# EAGLE schematic scheda_trasduttori (EAGLE 6.5.0)

## Sheet 1 of 4
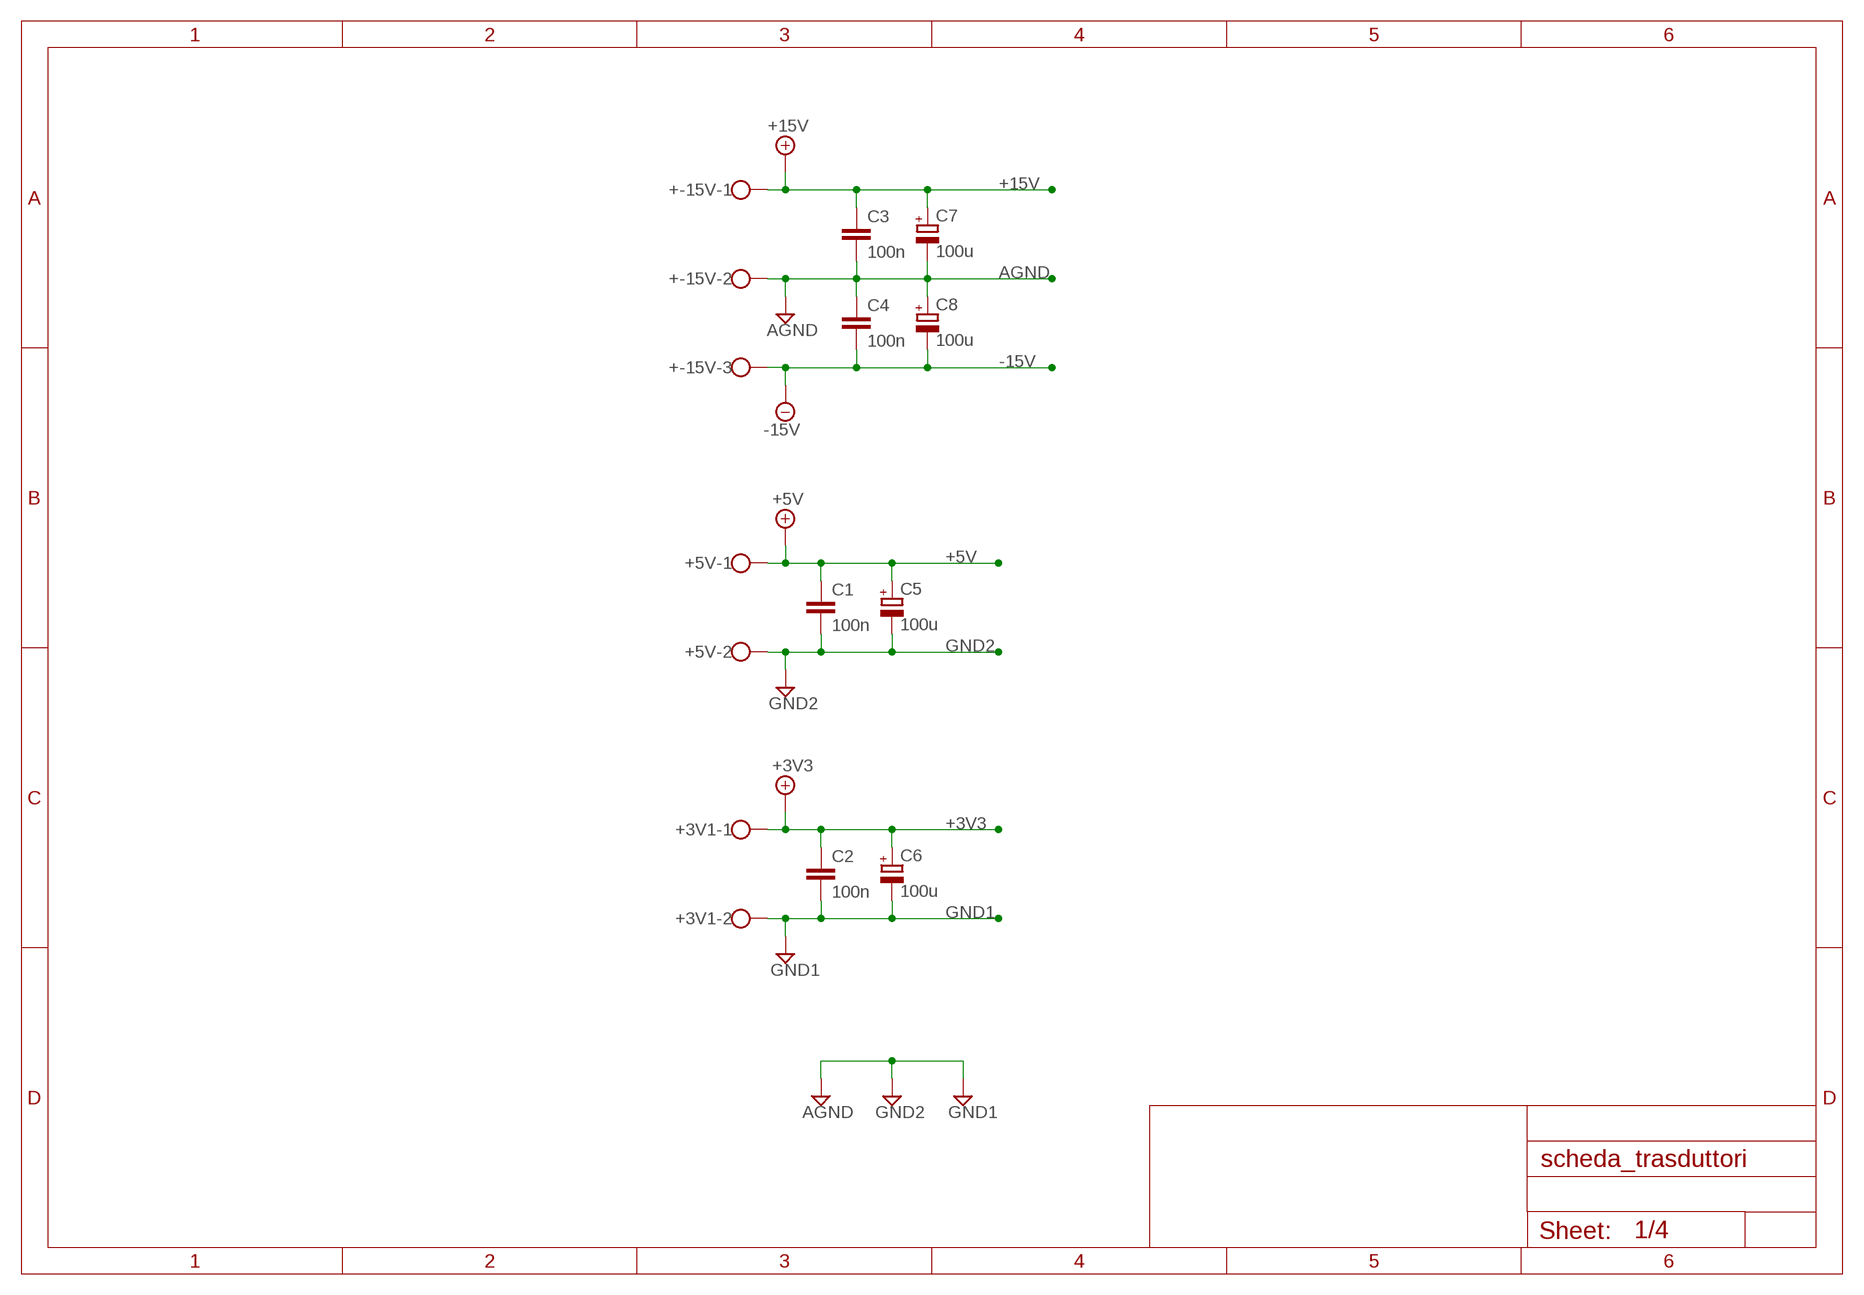
[diagram p0: schematic, sheet 1]

### Parts
+3V1  W237-102  [W237-102]
+5V  W237-102  [W237-102]
+-15V  W237-103  [W237-103]
C1  100n  C2,5-3  [C2.5-3]
C2  100n  C2,5-3  [C2.5-3]
C3  100n  C2,5-3  [C2.5-3]
C4  100n  C2,5-3  [C2.5-3]
C5  100u  CPOL-EUE2.5-7  [E2,5-7]
C6  100u  CPOL-EUE2.5-7  [E2,5-7]
C7  100u  CPOL-EUE2.5-7  [E2,5-7]
C8  100u  CPOL-EUE2.5-7  [E2,5-7]

### Nets
+3V3: +3V1.1 C2.1 C6.+
+5V: +5V.1 C1.1 C5.+ ; also sheet 2,4
+15V: +-15V.1 C3.1 C7.+ ; also sheet 2,3,4
-15V: +-15V.3 C4.2 C8.- ; also sheet 2,3,4
AGND: +-15V.2 C3.2 C4.1 C7.- C8.+ ; also sheet 2,3,4
GND1: +3V1.2 C2.2 C6.- ; also sheet 3
GND2: +5V.2 C1.2 C5.- ; supply symbol labelled AGND, GND1 ; also sheet 2,4

## Sheet 2 of 4
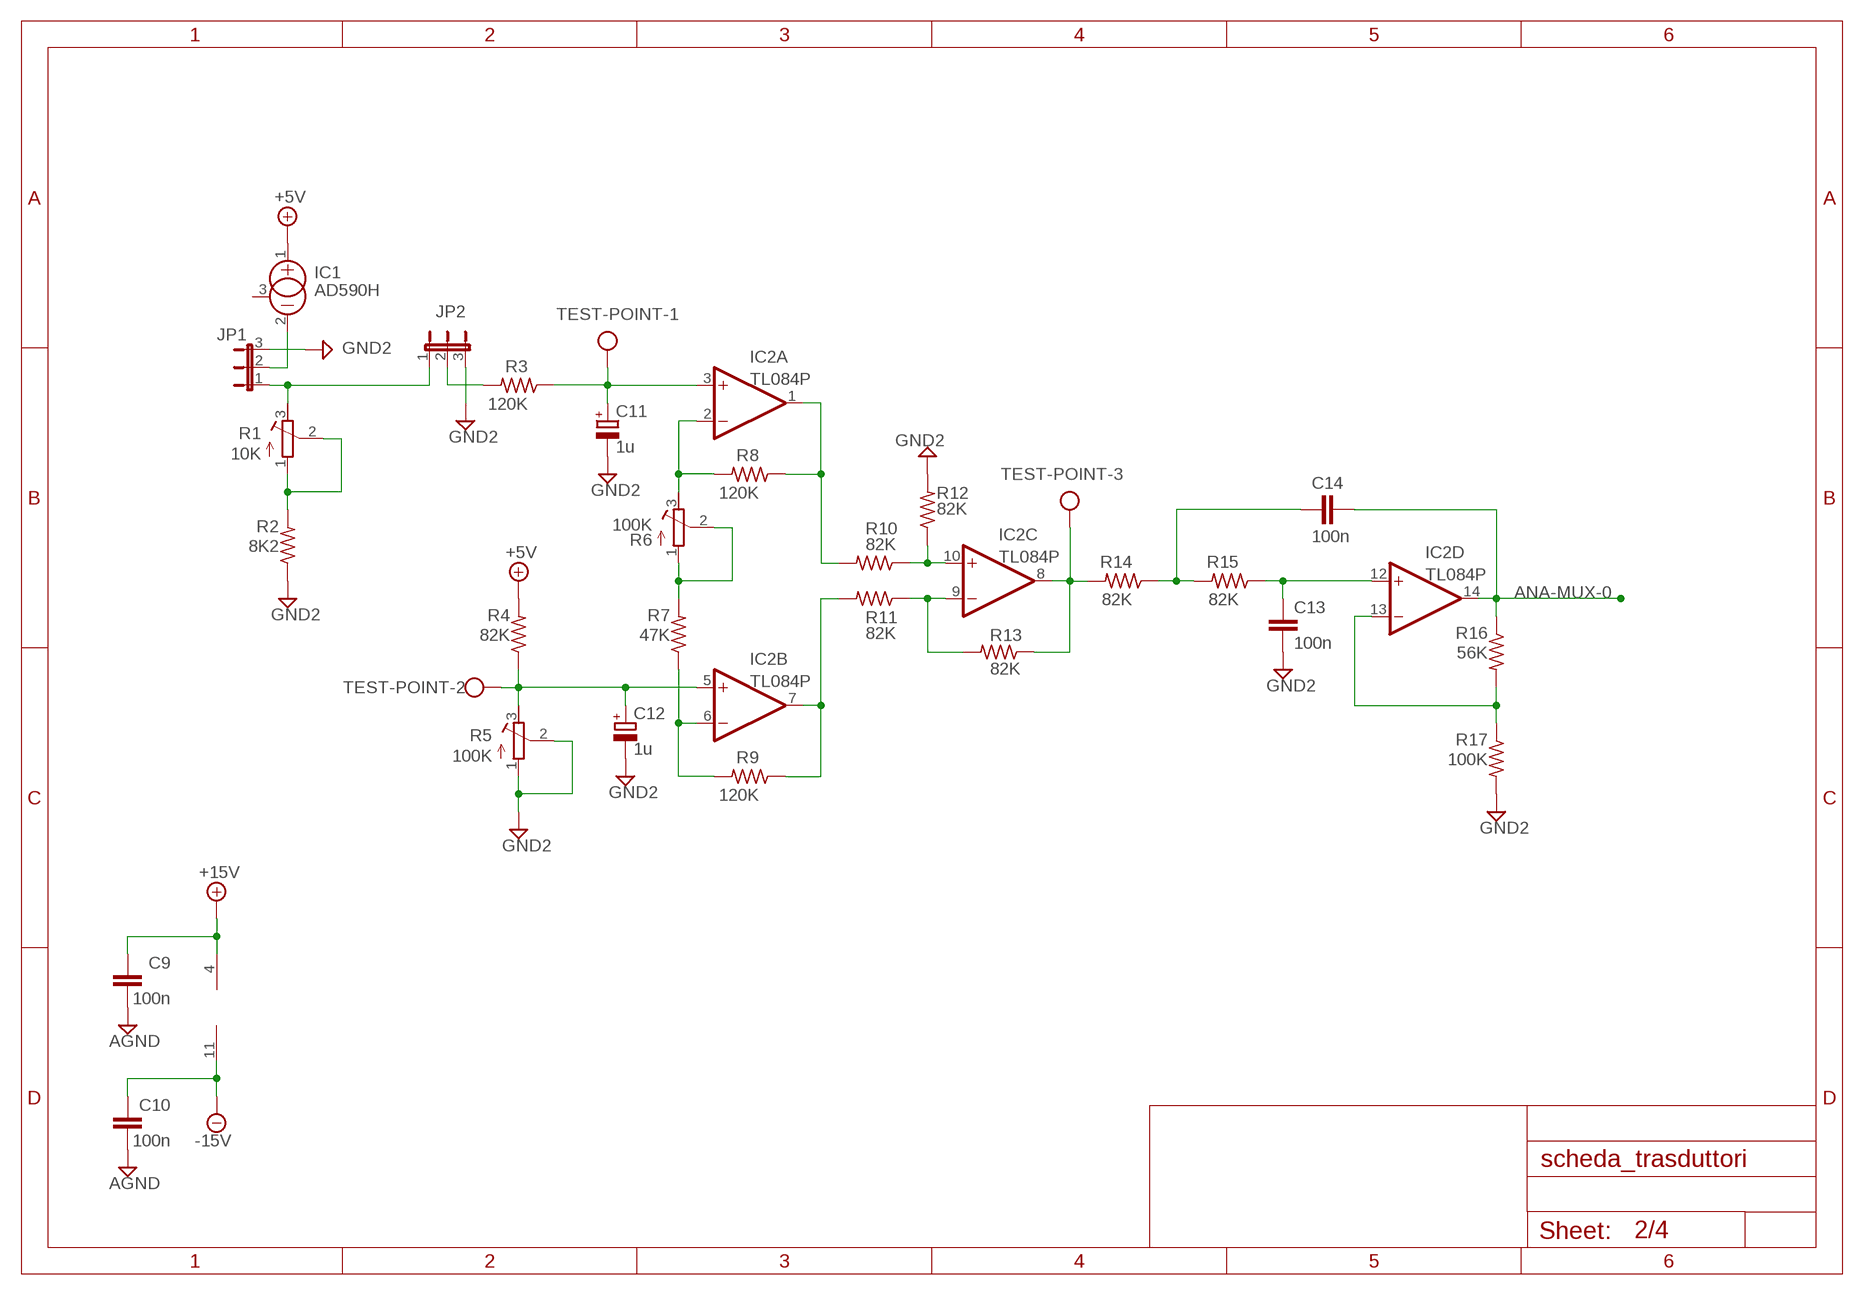
[diagram p1: schematic, sheet 2]

### Parts
C9  100n  C-EU025-024X044  [C025-024X044]
C10  100n  C-EU025-024X044  [C025-024X044]
C11  1u  CPOL-EUE5-8.5  [E5-8,5]
C12  1u  CPOL-EUE5-8.5  [E5-8,5]
C13  100n  C-EU025-024X044  [C025-024X044]
C14  100n  C-EU025-024X044  [C025-024X044]
IC1  AD590H  [TO18]
IC2  TL084P  [DIL14]
JP1  JP2E  [JP2]
JP2  JP2E  [JP2]
R1  10K  R-TRIMM64W  [RTRIM64W]
R2  8K2  R-US_0204/7  [0204/7]
R3  120K  R-US_0204/7  [0204/7]
R4  82K  R-US_0204/7  [0204/7]
R5  100K  R-TRIMM64W  [RTRIM64W]
R6  100K  R-TRIMM64W  [RTRIM64W]
R7  47K  R-US_0204/7  [0204/7]
R8  120K  R-US_0204/7  [0204/7]
R9  120K  R-US_0204/7  [0204/7]
R10  82K  R-US_0204/7  [0204/7]
R11  82K  R-US_0204/7  [0204/7]
R12  82K  R-US_0204/7  [0204/7]
R13  82K  R-US_0204/7  [0204/7]
R14  82K  R-US_0204/7  [0204/7]
R15  82K  R-US_0204/7  [0204/7]
R16  56K  R-US_0204/7  [0204/7]
R17  100K  R-US_0204/7  [0204/7]
TEST-POINT  W237-103  [W237-103]

### Nets
+5V: IC1.1(+) R4.2 ; also sheet 1,4
+15V: C9.2 IC2.4(P:V+) ; also sheet 1,3,4
-15V: C10.2 IC2.11(P:V-) ; also sheet 1,3,4
AGND: C9.1 C10.1 ; also sheet 1,3,4
ANA-MUX-0: C14.2 IC2.14(D:OUT) R16.1
GND2: C11.- C12.- C13.1 JP1.3 JP2.3 R2.1 R5.1(E) R5.2(S) R12.2 R17.2 ; also sheet 1,4
N$1: R1.1(E) R1.2(S) R2.2
N$2: IC1.2(-) JP1.2
N$3: R6.1(E) R6.2(S) R7.2
N$4: C11.+ IC2.3(A:+IN) R3.1 TEST-POINT.1
N$5: IC2.2(A:-IN) R6.3(A) R8.2
N$6: IC2.1(A:OUT) R8.1 R10.2
N$7: JP2.2 R3.2
N$8: JP1.1 JP2.1 R1.3(A)
N$9: C12.+ IC2.5(B:+IN) R4.1 R5.3(A) TEST-POINT.2
N$10: IC2.6(B:-IN) R7.1 R9.2
N$11: IC2.7(B:OUT) R9.1 R11.2
N$12: IC2.10(C:+IN) R10.1 R12.1
N$13: IC2.9(C:-IN) R11.1 R13.2
N$14: IC2.8(C:OUT) R13.1 R14.2 TEST-POINT.3
N$16: C14.1 R14.1 R15.2
N$17: C13.2 IC2.12(D:+IN) R15.1
N$18: IC2.13(D:-IN) R16.2 R17.1
Unconnected: IC1.3(CAN)

## Sheet 3 of 4
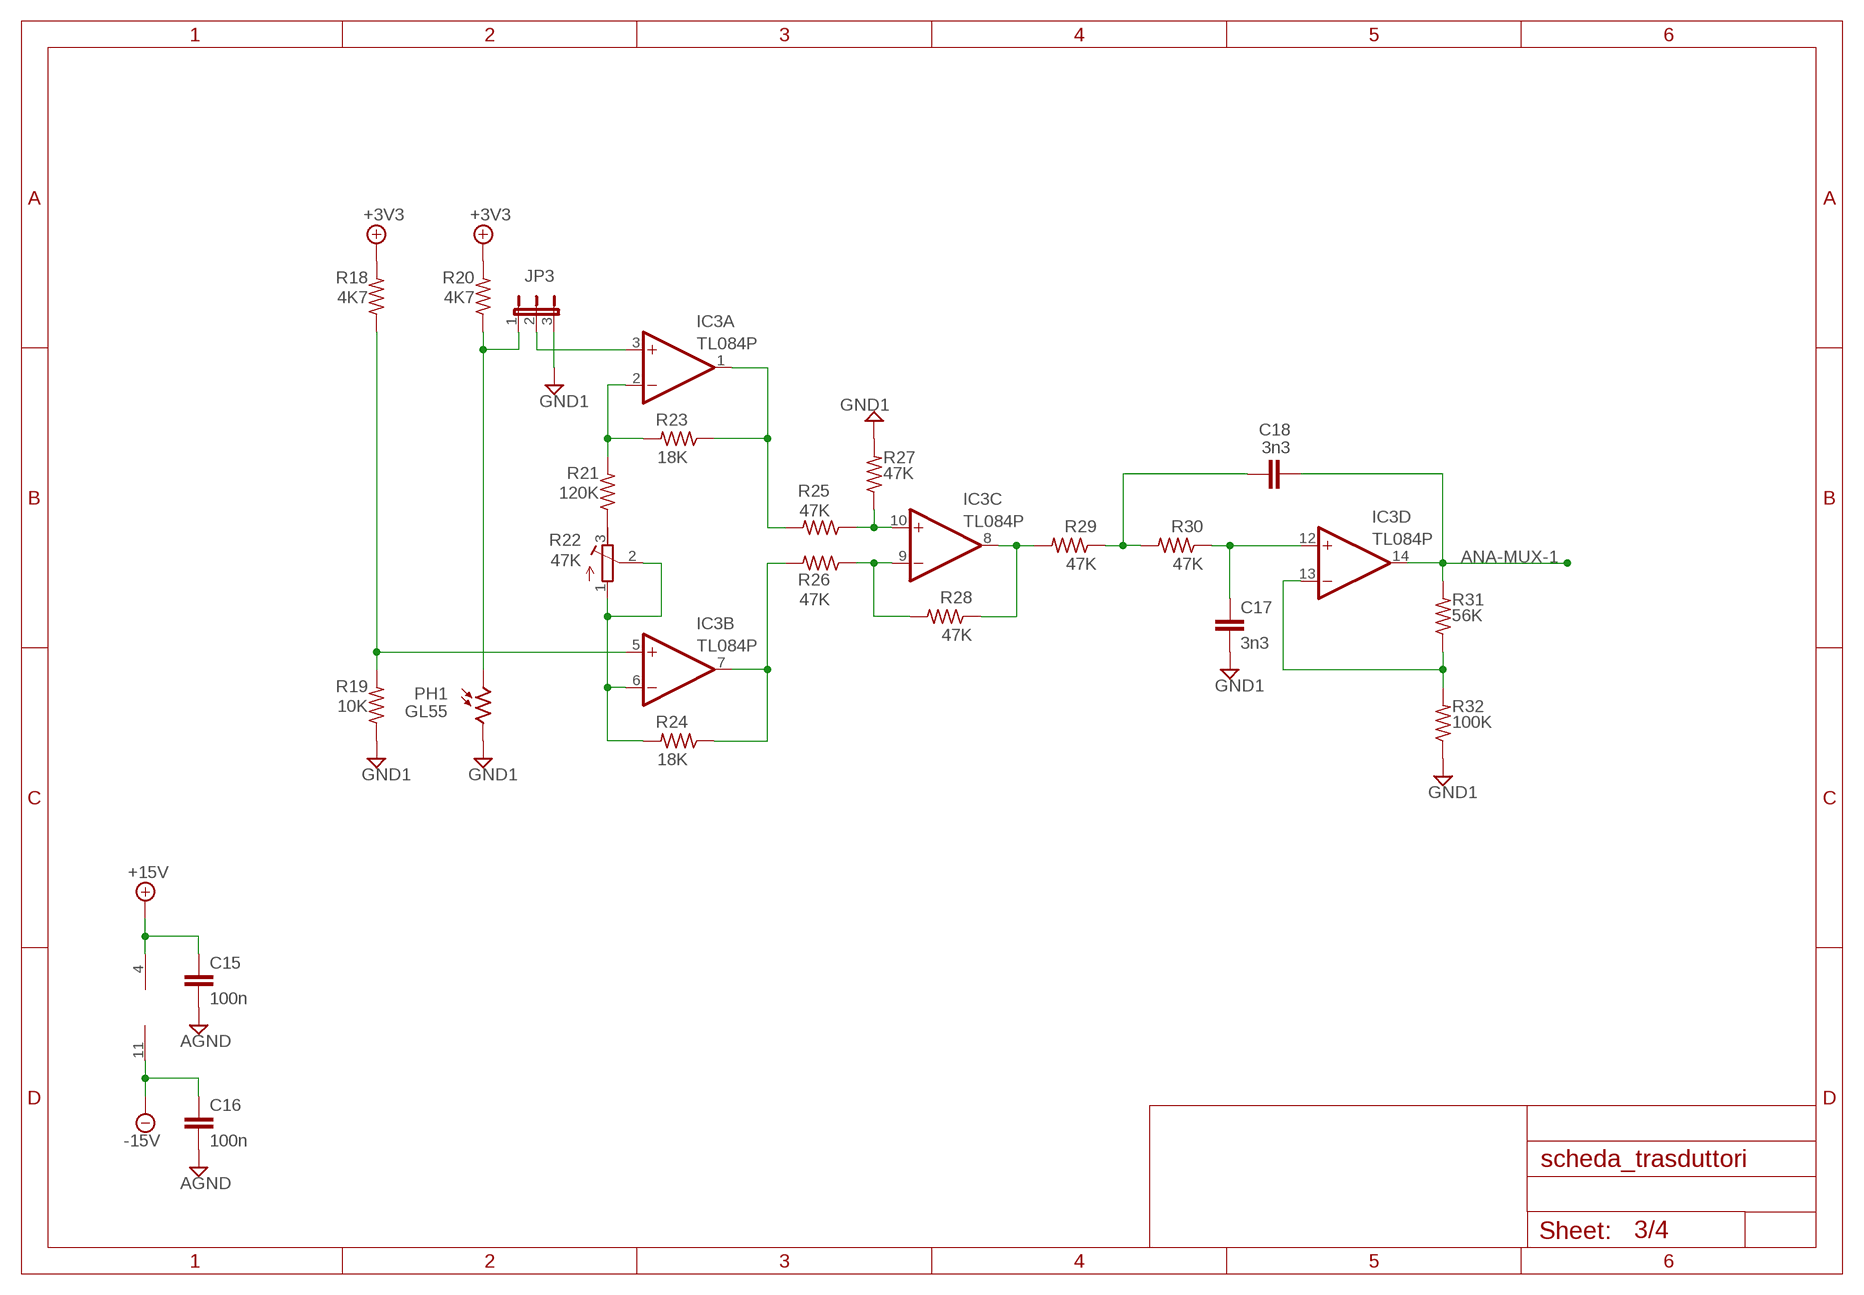
[diagram p2: schematic, sheet 3]

### Parts
C15  100n  C-EU025-025X050  [C025-025X050]
C16  100n  C-EU025-025X050  [C025-025X050]
C17  3n3  C-EU025-025X050  [C025-025X050]
C18  3n3  C-EU025-025X050  [C025-025X050]
IC3  TL084P  [DIL14]
JP3  JP2E  [JP2]
PH1  GL55  A1050_09  [T0-46-A10XX]
R18  4K7  R-US_0204/7  [0204/7]
R19  10K  R-US_0204/7  [0204/7]
R20  4K7  R-US_0204/7  [0204/7]
R21  120K  R-US_0204/7  [0204/7]
R22  47K  R-TRIMM64W  [RTRIM64W]
R23  18K  R-US_0204/7  [0204/7]
R24  18K  R-US_0204/7  [0204/7]
R25  47K  R-US_0204/7  [0204/7]
R26  47K  R-US_0204/7  [0204/7]
R27  47K  R-US_0204/7  [0204/7]
R28  47K  R-US_0204/7  [0204/7]
R29  47K  R-US_0204/7  [0204/7]
R30  47K  R-US_0204/7  [0204/7]
R31  56K  R-US_0204/7  [0204/7]
R32  100K  R-US_0204/7  [0204/7]

### Nets
+4.1V: R18.2 R20.2 ; supply symbol labelled +3V3
+15V: C15.1 IC3.4(P:V+) ; also sheet 1,2,4
-15V: C16.1 IC3.11(P:V-) ; also sheet 1,2,4
AGND: C15.2 C16.2 ; also sheet 1,2,4
ANA-MUX-1: C18.2 IC3.14(D:OUT) R31.2
GND1: C17.2 JP3.3 PH1.2 R19.1 R27.2 R32.1 ; also sheet 1
N$15: IC3.5(B:+IN) R18.1 R19.2
N$19: JP3.1 PH1.1 R20.1
N$20: R21.1 R22.3(A)
N$21: IC3.6(B:-IN) R22.1(E) R22.2(S) R24.2
N$22: IC3.7(B:OUT) R24.1 R26.2
N$23: IC3.1(A:OUT) R23.1 R25.2
N$24: IC3.2(A:-IN) R21.2 R23.2
N$25: IC3.10(C:+IN) R25.1 R27.1
N$26: IC3.9(C:-IN) R26.1 R28.2
N$27: IC3.8(C:OUT) R28.1 R29.2
N$28: C17.1 IC3.12(D:+IN) R30.1
N$29: IC3.13(D:-IN) R31.1 R32.2
N$30: C18.1 R29.1 R30.2
N$31: IC3.3(A:+IN) JP3.2

## Sheet 4 of 4
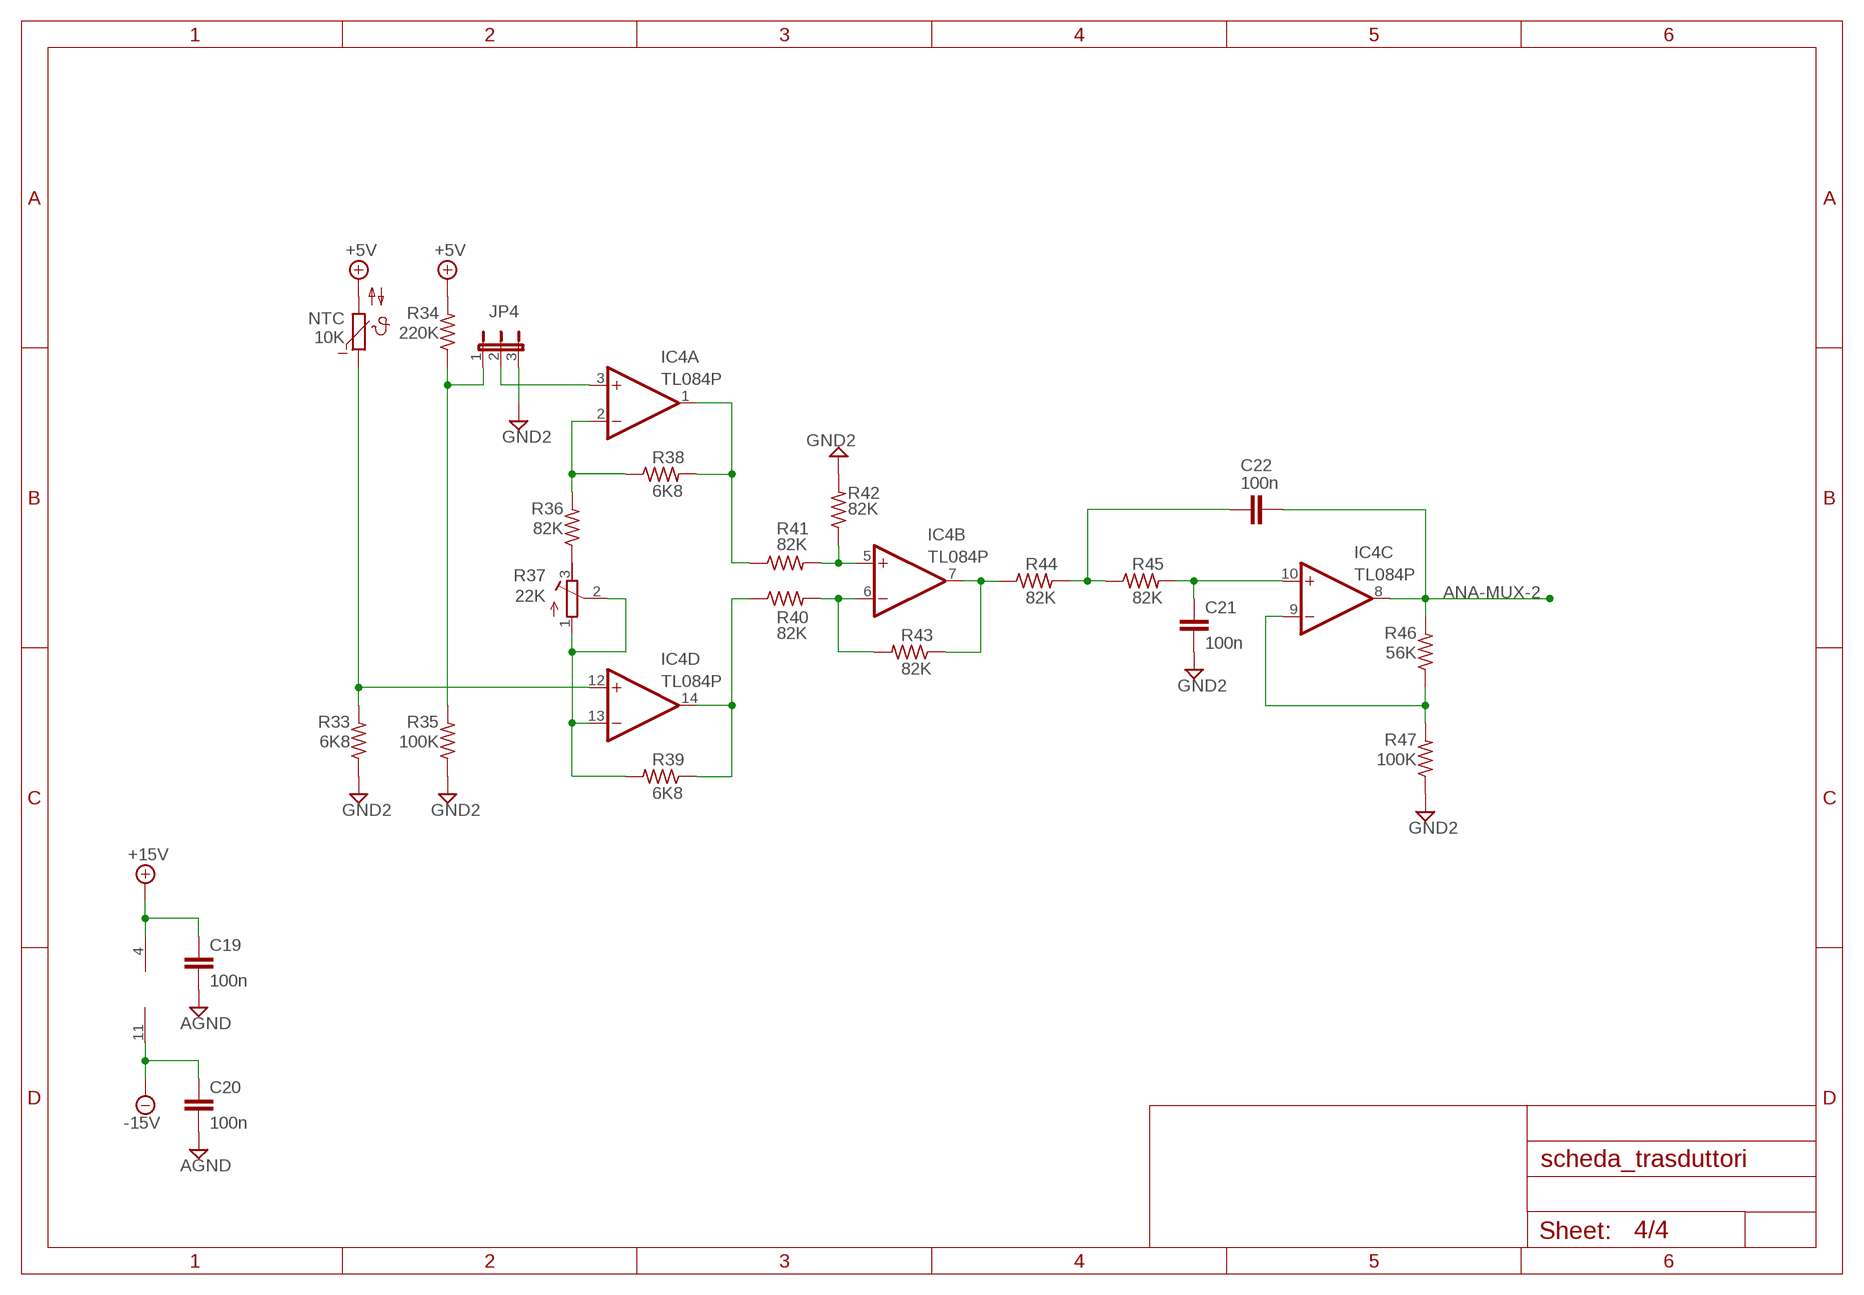
[diagram p3: schematic, sheet 4]

### Parts
C19  100n  C-EU025-025X050  [C025-025X050]
C20  100n  C-EU025-025X050  [C025-025X050]
C21  100n  C-EU025-025X050  [C025-025X050]
C22  100n  C-EU025-025X050  [C025-025X050]
IC4  TL084P  [DIL14]
JP4  JP2E  [JP2]
NTC  10K  NTC640  [P640]
R33  6K8  R-US_0204/7  [0204/7]
R34  220K  R-US_0204/7  [0204/7]
R35  100K  R-US_0204/7  [0204/7]
R36  82K  R-US_0204/7  [0204/7]
R37  22K  R-TRIMM64W  [RTRIM64W]
R38  6K8  R-US_0204/7  [0204/7]
R39  6K8  R-US_0204/7  [0204/7]
R40  82K  R-US_0204/7  [0204/7]
R41  82K  R-US_0204/7  [0204/7]
R42  82K  R-US_0204/7  [0204/7]
R43  82K  R-US_0204/7  [0204/7]
R44  82K  R-US_0204/7  [0204/7]
R45  82K  R-US_0204/7  [0204/7]
R46  56K  R-US_0204/7  [0204/7]
R47  100K  R-US_0204/7  [0204/7]

### Nets
+5V: NTC.2 R34.2 ; also sheet 1,2
+15V: C19.1 IC4.4(P:V+) ; also sheet 1,2,3
-15V: C20.1 IC4.11(P:V-) ; also sheet 1,2,3
AGND: C19.2 C20.2 ; also sheet 1,2,3
ANA-MUX-2: C22.2 IC4.8(C:OUT) R46.2
GND2: C21.2 JP4.3 R33.1 R35.1 R42.2 R47.1 ; also sheet 1,2
N$32: C21.1 IC4.10(C:+IN) R45.2
N$33: IC4.9(C:-IN) R46.1 R47.2
N$34: C22.1 R44.2 R45.1
N$35: IC4.12(D:+IN) NTC.1 R33.2
N$36: R36.1 R37.3(A)
N$37: IC4.2(A:-IN) R36.2 R38.1
N$38: IC4.1(A:OUT) R38.2 R40.1
N$39: IC4.13(D:-IN) R37.1(E) R37.2(S) R39.2
N$40: IC4.14(D:OUT) R39.1 R41.1
N$41: IC4.6(B:-IN) R41.2 R43.2
N$42: IC4.5(B:+IN) R40.2 R42.1
N$43: IC4.7(B:OUT) R43.1 R44.1
N$44: JP4.1 R34.1 R35.2
N$45: IC4.3(A:+IN) JP4.2

## Library data of the parts
+3V1 +5V = con-wago-500:W237-102: WAGO SCREW CLAMP; MPN: 237-102; OC_FARNELL: unknown; OC_NEWARK: 70K9898
+-15V TEST-POINT = con-wago-500:W237-103: WAGO SCREW CLAMP; MPN: 237-103; OC_FARNELL: unknown; OC_NEWARK: 18M7116
C1-C4 = capacitor-wima:C: CAPACITOR naming: grid - package width
C5-C8 C11 C12 = rcl:CPOL-EU: POLARIZED CAPACITOR, European symbol
C9 C10 C13-C22 = rcl:C-EU: CAPACITOR, European symbol
IC1 = linear:AD590H: TEMPERATURE SENSOR current output
IC2-IC4 = linear:TL084: OP AMP
JP1-JP4 = jumper:JP2E: JUMPER
NTC = ptc-ntc:NTC640: PHILIPS NTC; OC_FARNELL: unknown; OC_NEWARK: unknown
PH1 = photo-elements:A10: Sensor Robust Light Sensing Applications Outdoor Light Sensing Application Source: http://optoelectronics.perkinelmer.com/content/Datasheets/DTS_PhotocellsA1050.pdf; TYPE: GL55
R1 R5 R6 R22 R37 = resistor:R-TRIMM: Trimm resistor
R2-R4 R7-R21 R23-R32 = rcl:R-US_: RESISTOR, American symbol
R33-R36 R38-R47 = resistor:R-US_: RESISTOR, American symbol